# EAGLE design powersupplyboard (EAGLE 9.6.2)
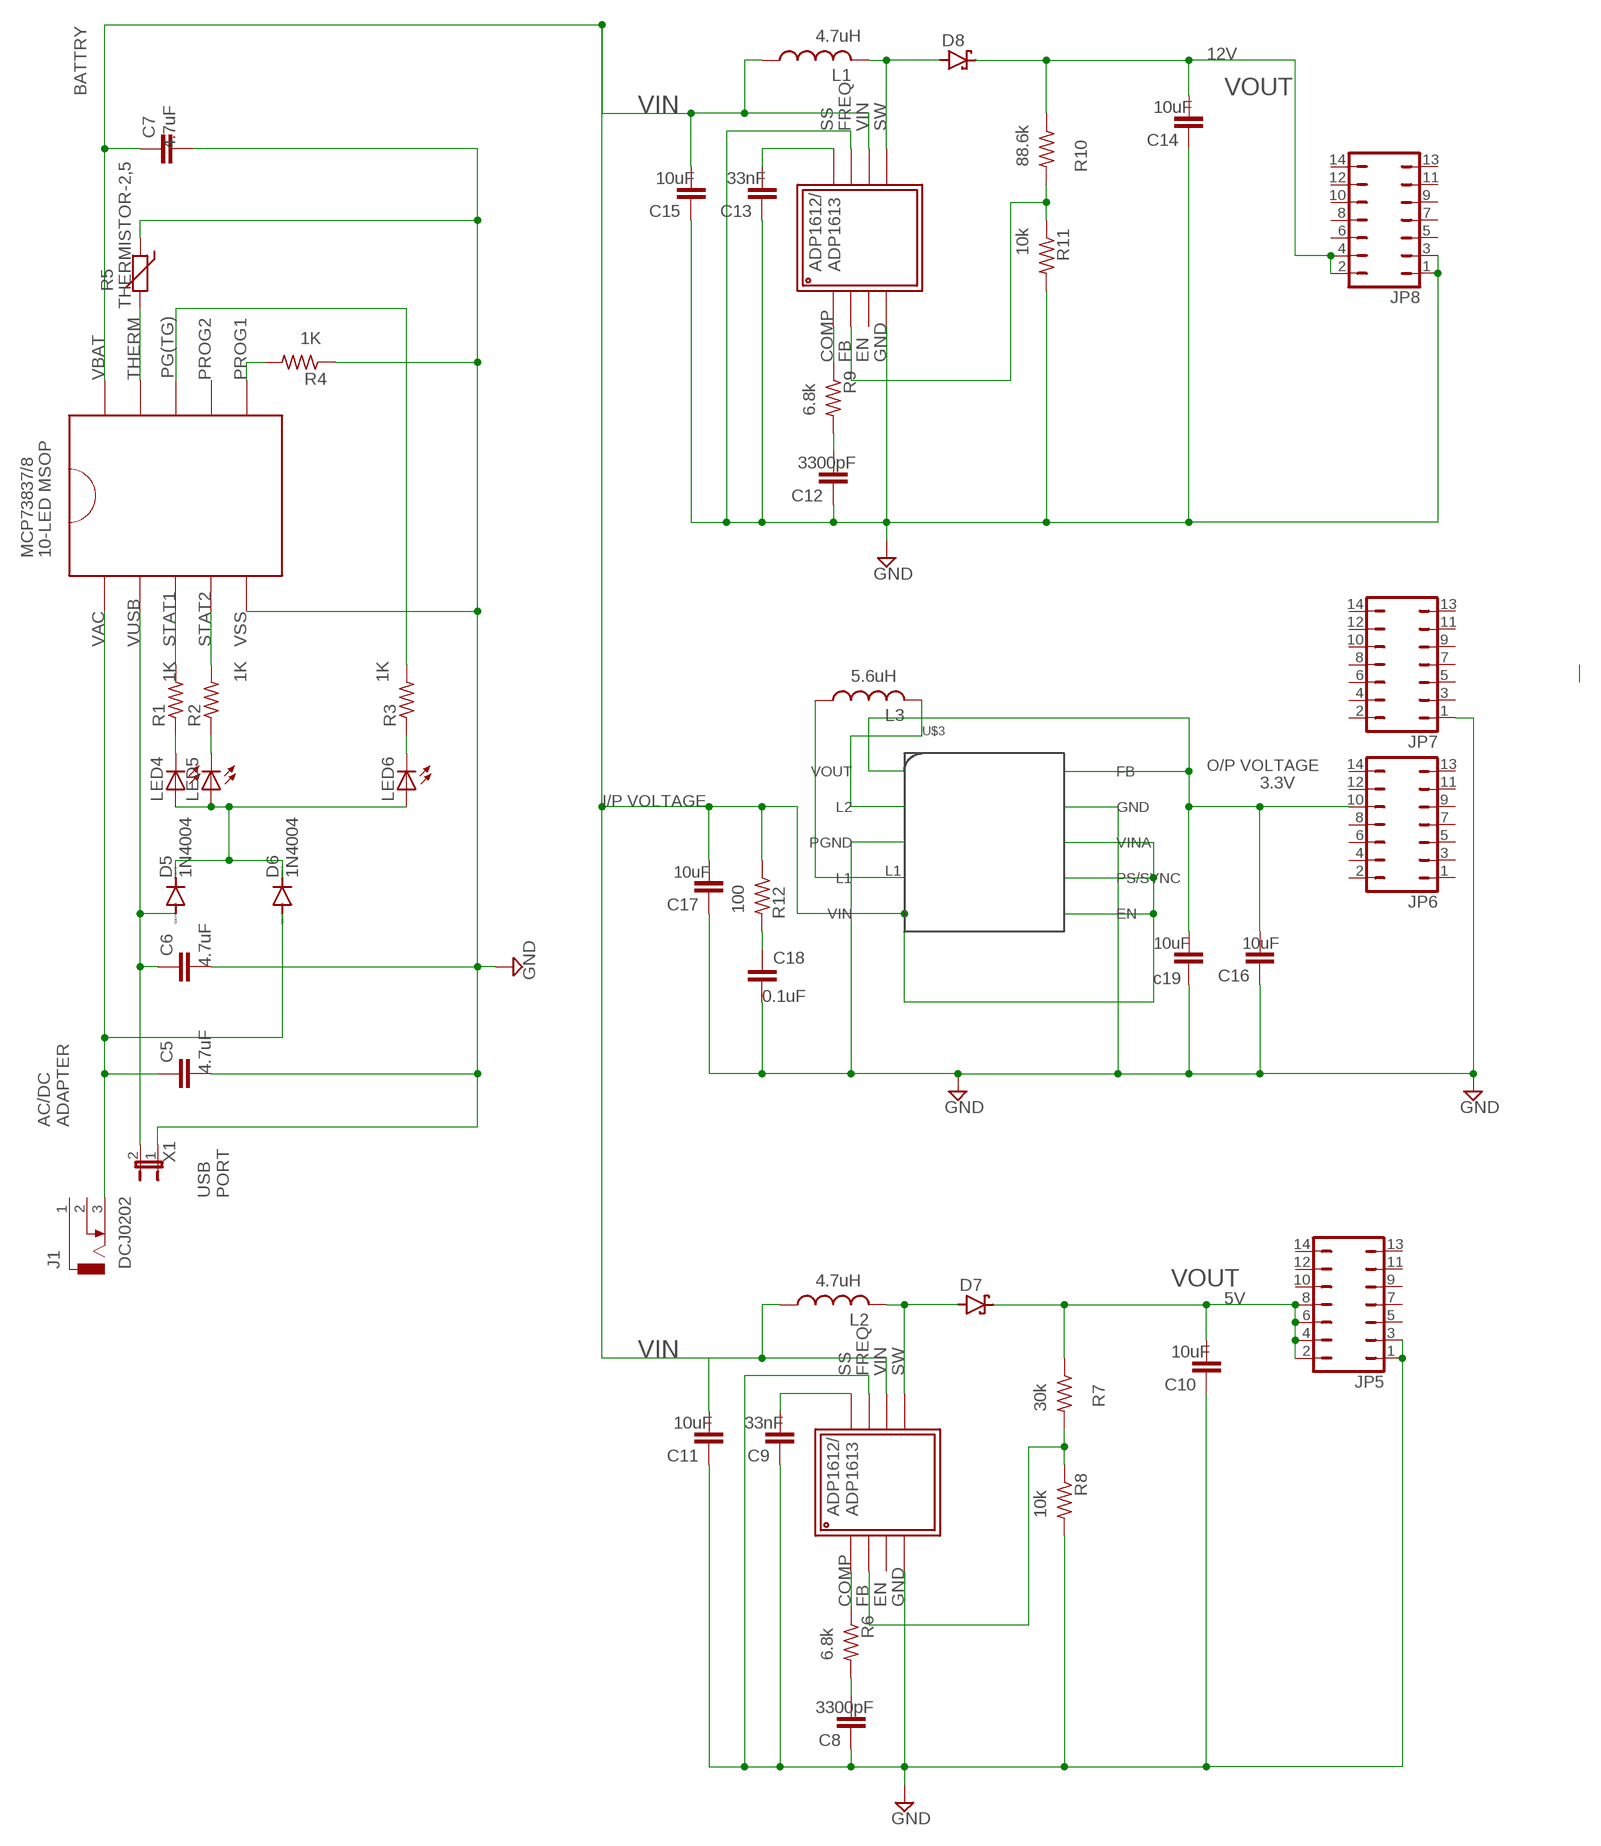
[diagram p0: schematic, sheet 1]

## Parts
C1  C2,5-3  [C2.5-3]
C5  C2.5/5  [C2.5-5]
C6  C2.5/5  [C2.5-5]
C7  C2.5/5  [C2.5-5]
C8  C2,5-3  [C2.5-3]
C9  C2,5-3  [C2.5-3]
C10  C2,5-3  [C2.5-3]
C11  C2,5-3  [C2.5-3]
C12  C2,5-3  [C2.5-3]
C13  C2,5-3  [C2.5-3]
C14  C2,5-3  [C2.5-3]
C15  C2,5-3  [C2.5-3]
C16  C2,5-3  [C2.5-3]
C17  C2,5-3  [C2.5-3]
C18  C2,5-3  [C2.5-3]
D5  1N4004  [DO41-10]
D6  1N4004  [DO41-10]
D7  SCHOTTKY-DIODEC4111-15  [C4111-15]
D8  SCHOTTKY-DIODEC4111-15  [C4111-15]
J1  DCJ0202  [DCJ0202]
JP1  JP1E  [JP1]
JP5  JP7Q  [JP7Q]
JP6  JP7Q  [JP7Q]
JP7  JP7Q  [JP7Q]
JP8  JP7Q  [JP7Q]
L1  L-US0204/5  [0204/5]
L2  L-US0204/5  [0204/5]
L3  L-US0204/5  [0204/5]
LED4  LED3MM  [LED3MM]
LED5  LED3MM  [LED3MM]
LED6  LED3MM  [LED3MM]
R1  R-US_0204/2V  [0204V]
R2  R-US_0204/2V  [0204V]
R3  R-US_0204/2V  [0204V]
R4  R-US_0204/2V  [0204V]
R5  THERMISTOR-2,5  [RS-2,5]
R6  R-US_0204/2V  [0204V]
R7  R-US_0204/2V  [0204V]
R8  R-US_0204/2V  [0204V]
R9  R-US_0204/2V  [0204V]
R10  R-US_0204/2V  [0204V]
R11  R-US_0204/2V  [0204V]
R12  R-US_0204/2V  [0204V]
U$1  ADP1612  [ADP1612]
U$2  ADP1612  [ADP1612]
U$3  TPS63002  [TPS63002]
U$4  MCP73837/8  [MCP73837/8]

## Nets
GND: C1.1 C5.2 C6.2 C7.2 C8.1 C9.1 C10.1 C11.1 C12.1 C13.1 C14.1 C15.1 C16.1 C17.1 C18.2 JP1.1 JP5.1 JP5.3 JP7.1 JP8.1 JP8.3 R4.1 R5.1 R8.2 R11.2 U$1.P$4 U$1.P$6 U$2.P$4 U$2.P$6 U$3.GND U$3.PGND U$4.P$5
N$1: C7.1 C11.2 C15.2 C17.2 L1.1 L2.1 R12.1 U$1.P$7 U$2.P$7 U$3.EN U$3.PS/SYNC U$3.VIN U$3.VINA U$4.P$10
N$2: L3.1 U$3.L1
N$4: C1.2 C16.2 JP6.10 U$3.FB U$3.VOUT
N$5: L3.2 U$3.L2
N$6: C18.1 R12.2
N$7: C5.1 D6.A J1.3 U$4.P$1
N$8: C10.2 D7.C JP5.2 JP5.4 JP5.6 JP5.8 R7.1
N$9: C14.2 D8.C JP8.2 JP8.4 R10.1
N$11: C6.1 D5.A JP1.2 U$4.P$2
N$12: D5.C D6.C LED4.A LED5.A LED6.A
N$13: R4.2 U$4.P$6
N$14: R5.2 U$4.P$9
N$15: LED4.K(C) R1.1
N$16: R1.2 U$4.P$3
N$17: R2.2 U$4.P$4
N$18: LED5.K(C) R2.1
N$19: LED6.K(C) R3.1
N$20: R3.2 U$4.P$8
N$24: D7.A L2.2 U$1.P$8
N$25: R6.1 U$1.P$1
N$26: C8.2 R6.2
N$27: R7.2 R8.1 U$1.P$2
N$28: C9.2 U$1.P$5
N$30: D8.A L1.2 U$2.P$8
N$32: R9.1 U$2.P$1
N$33: C12.2 R9.2
N$34: R10.2 R11.1 U$2.P$2
N$35: C13.2 U$2.P$5
Unconnected: J1.1 J1.2 JP5.5 JP5.7 JP5.9 JP5.10 JP5.11 JP5.12 JP5.13 JP5.14 JP6.1 JP6.2 JP6.3 JP6.4 JP6.5 JP6.6 JP6.7 JP6.8 JP6.9 JP6.11 JP6.12 JP6.13 JP6.14 JP7.2 JP7.3 JP7.4 JP7.5 JP7.6 JP7.7 JP7.8 JP7.9 JP7.10 JP7.11 JP7.12 JP7.13 JP7.14 JP8.5 JP8.6 JP8.7 JP8.8 JP8.9 JP8.10 JP8.11 JP8.12 JP8.13 JP8.14 U$1.P$3 U$2.P$3 U$4.P$7

## Notes on the sheet
- 4.7uH
- 12V
- BATTRY | VOUT
- VIN | 10uF
- 4.7uF
- 88.6k
- 10uF | 33nF
- 10k
- 1K
- 6.8k
- 3300pF
- 1K | 1K | 1K | 5.6uH
- O/P VOLTAGE
- 3.3V
- I/P VOLTAGE
- 10uF
- 100
- 10uF | 10uF
- 4.7uF
- c19
- 0.1uF
- 4.7uF
- AC/DC
  ADAPTER
- X1
- USB
  PORT
- 4.7uH | VOUT
- 5V
- VIN | 10uF
- 30k
- 10uF | 33nF
- 10k
- 6.8k
- 3300pF

## Library data of the parts
C1 C5-C18 = capacitor-wima:C: CAPACITOR naming: grid - package width
D5 D6 = diode:1N4004: DIODE general purpose rectifier, 1 A
D7 D8 = diode:SCHOTTKY-DIODE: Schottky Diode
J1 = con-jack:DCJ0202: DC POWER JACK Source: DCJ0202.pdf; OC_FARNELL: unknown; OC_NEWARK: unknown
JP1 = jumper:JP1E: JUMPER
JP5-JP8 = jumper:JP7Q: JUMPER
L1-L3 = rcl:L-US: INDUCTOR, American symbol; SPICEPREFIX: L
LED4-LED6 = adafruit:LED: LED OSRAM: - CHIPLED LG R971, LG N971, LY N971, LG Q971, LY Q971, LO R971, LY R971 LH N974, LH R974 LS Q976, LO Q976, LY Q976 LO Q996 - Hyper CHIPLED LW Q18S LB Q993, LB Q99A, LB R99A - SideLED LS A670, LO A670, LY A670, LG A670, LP A670 LB A673, LV A673, LT A673, LW A673 LH A674 LY A675 LS A676, LA A676, LO A676, LY A676, LW A676 LS A679, LY A679, LG A679 - Hyper Micro SIDELED® LS Y876, LA Y876, LO Y876, LY Y876 LT Y87S - SmartLED LW L88C, LW L88S LB L89C, LB L89S, LG L890 LS L89K, LO L89K, LY L89K LS L896, LA L896, LO L896, LY L896 - TOPLED LS T670, LO T670, LY T670, LG T670, LP T670 LSG T670, LSP T670, LSY T670, LOP T670, LYG T670 LG T671, LOG T671, LSG T671 LB T673, LV T673, LT T673, LW T673 LH T674 LS T676, LA T676, LO T676, LY T676, LB T676, LH T676, LSB T676, LW T676 LB T67C, LV T67C, LT T67C, LS T67K, LO T67K, LY T67K, LW E67C LS E67B, LA E67B, LO E67B, LY E67B, LB E67C, LV E67C, LT E67C LW T67C LS T679, LY T679, LG T679 LS T770, LO T770, LY T770, LG T770, LP T770 LB T773, LV T773, LT T773, LW T773 LH T774 LS E675, LA E675, LY E675, LS T675 LS T776, LA T776, LO T776, LY T776, LB T776 LHGB T686 LT T68C, LB T68C - Hyper Mini TOPLED® LB M676 - Mini TOPLED Santana® LG M470 LS M47K, LO M47K, LY M47K Source: http://www.osram.convergy.de/
R1-R4 R6-R12 = rcl:R-US_: RESISTOR, American symbol; SPICEPREFIX: R
R5 = varistor:THERMISTOR: THERMISTOR
U$1 U$2 = ADP1612:ADP1612
U$3 = TPS63002:TPS63002
U$4 = MCP73837:MCP73837/8

## Board
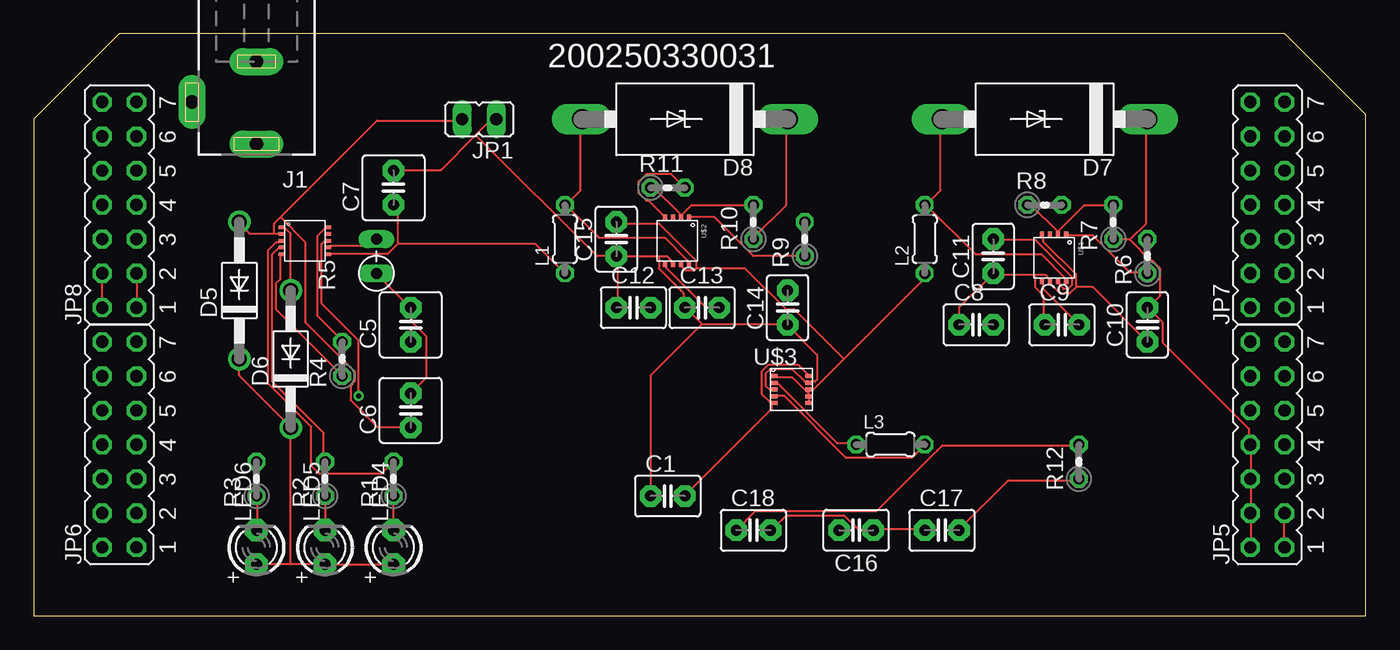
[diagram p1: board, top side]
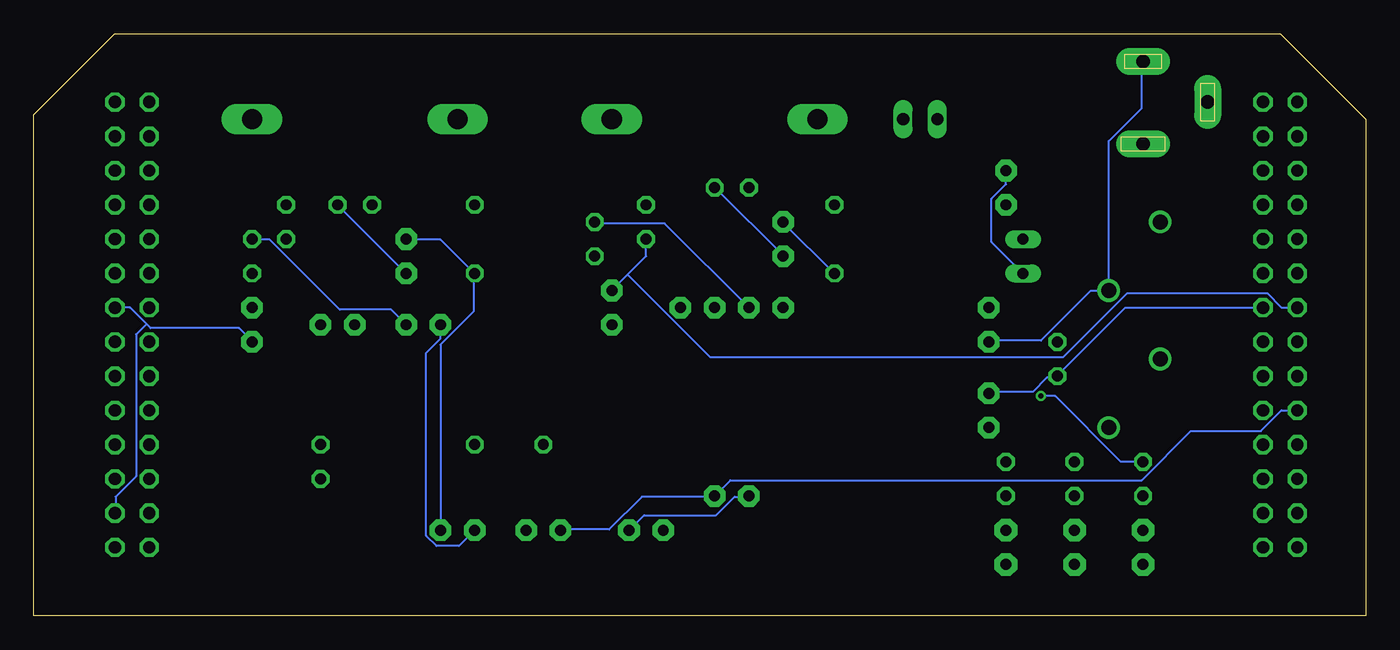
[diagram p2: board, bottom side, seen from below]

Size 98.73 x 43.17 mm. Coordinates in mm from the lower left corner, seen from the top.
Outline: 0,0 98.73,0 98.73,37.16 92.72,43.17 6.34,43.17 0,36.83 0,0
Copper layers (1*16): Top 0.035mm / dielectric 1.5mm / Bottom 0.035mm
Design rules "default": minimum track width 6mil, minimum drill 0.35mm, track to track 6mil, track to pad 6mil, pad to pad 6mil, via to via 6mil, smd to smd 6mil, copper to edge 40mil, drill to drill 6mil, minimum pad ring 10mil, minimum via ring 8mil, stop-mask expansion 4mil, vias tented up to drill 0mil, thermal gap 10mil

### Footprints (pad centres in the part's own frame; a part is rotated, then mirrored left to right if it is on the bottom)
C2.5-3 = drill 0.813 pad 1.6 octagon: 1 -1.27,0; 2 1.27,0
C2.5-5 = drill 0.813 pad 1.6 octagon: 1 -1.27,0; 2 1.27,0
DO41-10 = drill 1.118: A 5.08,0; C -5.08,0
C4111-15 = drill 1.499 long: A 7.62,0; C -7.62,0
DCJ0202 = drill 1 pad 2 long: 1 0,3.1; 2 4.8,0; 3 0,-3
JP1 = drill 0.914 long: 1 0,-1.27; 2 0,1.27
JP7Q = drill 0.914 octagon: 1 -7.62,-1.27; 2 -7.62,1.27; 3 -5.08,-1.27; 4 -5.08,1.27; 5 -2.54,-1.27; 6 -2.54,1.27; 7 0,-1.27; 8 0,1.27; 9 2.54,-1.27; 10 2.54,1.27; 11 5.08,-1.27; 12 5.08,1.27; 13 7.62,-1.27; 14 7.62,1.27
0204/5 = drill 0.813 octagon: 1 -2.54,0; 2 2.54,0
LED3MM = drill 0.813 pad 1.676 octagon: A -1.27,0; K 1.27,0
0204V = drill 0.813 octagon: 1 -1.27,0; 2 1.27,0
RS-2,5 = drill 0.813 long: 1 -1.27,0; 2 1.27,0
ADP1612 = smd 0.4 x 0.3: P$1 -9.25,5.4; P$2 -9.25,4.8; P$3 -9.25,4.2; P$4 -9.25,3.6; P$5 -5.75,3.6; P$6 -5.75,4.2; P$7 -5.75,4.8; P$8 -5.75,5.4
TPS63002 = smd 0.5 x 0.3: EN 2.85,0.55; FB 2.85,2.55; GND 2.85,2.05; L1 0.25,2.05; L2 0.25,1.05; PGND 0.25,1.55; PS/SYNC 2.85,1.05; VIN 0.25,2.55; VINA 2.85,1.55; VOUT 0.25,0.55
MCP73837/8 = smd 0.4 x 0.25: P$1 -3.25,8.5; P$2 -3.25,8; P$3 -3.25,7.5; P$4 -3.25,7; P$5 -3.25,6.5; P$6 0.25,8.5; P$7 0.25,8; P$8 0.25,7.5; P$9 0.25,7; P$10 0.25,6.5

### Placement (x,y rotation side)
C1  46.99,8.89 0 top
C5  27.94,21.59 90 top
C6  27.94,15.24 90 top
C7  26.67,31.75 90 top
C8  69.85,21.59 0 top
C9  76.2,21.59 0 top
C10  82.55,21.59 90 top
C11  71.12,26.67 90 top
C12  44.45,22.86 0 top
C13  49.53,22.86 0 top
C14  55.88,22.86 90 top
C15  43.18,27.94 90 top
C16  60.96,6.35 180 top
C17  67.31,6.35 0 top
C18  53.34,6.35 0 top
D5  15.24,24.13 90 top
D6  19.05,19.05 90 top
D7  74.93,36.83 180 top
D8  48.26,36.83 180 top
J1  16.51,38.1 180 top
JP1  33.02,36.83 90 top
JP5  91.44,12.7 90 top
JP6  6.35,12.7 90 top
JP7  91.44,30.48 90 top
JP8  6.35,30.48 90 top
L1  39.37,27.94 90 top
L2  66.04,27.94 90 top
L3  63.5,12.7 0 top
LED4  26.67,5.08 90 top
LED5  21.59,5.08 90 top
LED6  16.51,5.08 90 top
R1  26.67,10.16 90 top
R2  21.59,10.16 90 top
R3  16.51,10.16 90 top
R4  22.86,19.05 90 top
R5  25.4,26.67 90 top
R6  82.55,26.67 90 top
R7  80.01,29.21 90 top
R8  74.93,30.48 0 top
R9  57.15,27.94 90 top
R10  53.34,29.21 90 top
R11  46.99,31.75 0 top
R12  77.47,11.43 90 top
U$1  71.12,19.05 270 top
U$2  43.18,20.32 270 top
U$3  54.61,15.24 0 top
U$4  21.59,20.32 0 top

### Tracks (layer width: path | path; a pad name or v marks a point on that pad's centre or on a via)
GND
  Top 0.152: 74.22,25.3 71.17,25.3 C11.1 68.58,22.86 C8.1 | 74.22,25.3 74.98,25.3 75.29,24.99 75.29,24.84 U$1.P$6 75.29,24.69 76.05,23.93 76.81,23.93 77.27,24.38 | 77.27,24.38 77.27,25.3 74.83,27.74 74.83,28.19 U$1.P$4 | 74.22,25.3 74.22,24.38 74.83,23.77 74.83,21.64 C9.1 | JP5.1 92.66,5.18 92.66,7.62 JP5.3 | 77.27,24.38 78.49,24.38 C10.1 | 32.77,35.66 30.18,33.07 26.67,33.07 C7.2 | 32.77,35.66 33.83,36.73 34.29,36.73 JP1.1 | R5.1 25.45,25.3 27.89,22.86 C5.2 28.04,22.86 28.04,21.79 29.11,20.73 29.11,17.68 C6.2 | JP8.3 JP8.1 | U$4.P$5 18.29,26.82 18.29,24.99 17.98,24.69 17.98,22.71 22.86,17.83 R4.1 | C17.1 65.99,6.4 62.33,6.4 C16.1 62.18,6.4 61.11,6.4 60.05,7.47 55.78,7.47 54.71,6.4 C18.2 | U$3.PGND 54.71,16.76 54.56,16.76 54.25,17.07 54.25,17.98 54.56,18.29 56.24,18.29 57.15,17.37 57.45,17.37 U$3.GND 57.61,17.37 57.91,17.37 58.06,17.53 58.06,19.35 55.93,21.49 C14.1 55.78,21.64 49.53,21.64 | R11.2 47.24,32.77 45.41,32.77 44.81,32.16 44.81,31.39 45.41,30.78 45.57,30.78 46.63,29.72 U$2.P$4 | 43.28,26.67 46.33,26.67 | 46.33,26.67 46.94,26.67 47.24,26.36 47.24,26.21 U$2.P$6 | 43.28,26.67 43.28,22.86 C12.1 | 43.28,26.67 C15.1 41.76,26.67 32.77,35.66 | 46.33,26.67 46.33,25.76 48.16,23.93 48.16,22.86 C13.1 48.31,22.86 49.53,21.64 | C1.1 45.72,17.83 49.53,21.64
  Bottom 0.152: C11.1 R8.2 | JP7.1 91.59,22.86 90.37,21.64 | 90.37,21.64 90.07,21.34 83.52,21.34 82.6,20.42 C10.1 | 90.37,21.64 91.13,20.88 91.13,10.36 92.66,8.84 92.66,7.62 JP5.3 | C6.2 27.89,16.61 24.69,16.61 23.62,17.68 22.86,17.68 R4.1 22.86,17.83 17.83,22.86 JP8.1 | C7.2 26.67,32 27.74,30.94 27.74,27.74 R5.1 | C18.2 53.49,7.47 48.16,7.47 46.79,8.84 45.72,8.84 C1.1 | R11.2 48.16,31.7 43.13,26.67 C15.1 | C8.1 68.58,20.57 69.65,19.51 69.65,5.94 68.88,5.18 67.21,5.18 C17.1
N$1
  Top 0.152: 26.98,27.58 26.21,26.82 21.95,26.82 U$4.P$10 | 26.98,27.58 26.98,30.17 C7.1 | 49.07,25.76 48.92,25.6 48.31,25.6 48.01,25.91 48.01,26.06 U$2.P$7 | 49.07,25.76 49.07,26.36 46.33,29.11 43.28,29.11 C15.2 | 26.98,27.58 37.19,27.58 L1.1 | R12.1 77.42,10.06 72.24,10.06 68.58,6.4 C17.2 | U$1.P$7 76.05,24.69 76.05,24.54 76.35,24.23 76.66,24.23 76.96,24.54 76.96,25.15 74.22,27.89 71.17,27.89 C11.2 | U$3.EN 57.45,15.85 57.45,16.15 U$3.PS/SYNC 57.45,16.31 57.45,16.46 | 57.45,16.46 57.45,16.76 U$3.VINA 57.61,16.76 57.76,16.76 60.05,19.05 | 57.45,16.46 56.24,17.68 54.86,17.68 U$3.VIN | 60.05,19.05 65.99,24.99 65.99,25.3 L2.1 | 49.07,25.76 52.73,25.76 55.78,22.71 56.39,22.71 60.05,19.05
  Bottom 0.152: L1.1 39.47,25.45 43.13,29.11 C15.2 | C11.2 71.02,27.89 68.58,27.89 66.14,25.45 L2.1 66.14,25.3 66.14,22.55 68.58,20.12 C17.2
N$2
  Top 0.152: U$3.L1 54.86,17.22 55.17,17.22 59.59,12.8 60.96,12.8 L3.1
N$4
  Top 0.152: U$3.FB 57.45,17.83 56.69,18.59 54.41,18.59 53.95,18.14 53.95,16.46 54.56,15.85 54.71,15.85 U$3.VOUT 54.71,15.7 54.71,15.39 48.31,8.99 C1.2
  Bottom 0.152: JP6.10 6.25,15.24 7.77,13.72 12.95,13.72 16.61,10.06 47.09,10.06 C1.2 48.31,8.84 53.64,8.84 56.08,6.4 59.59,6.4 C16.2
N$5
  Top 0.152: L3.2 65.08,11.74 60.2,11.74 55.63,16.31 54.86,16.31 U$3.L2
N$6
  Top 0.152: C18.1 53.49,7.77 62.48,7.77 67.36,12.65 77.42,12.65 R12.2
N$7
  Top 0.152: D6.A 19.05,28.35 18.59,28.8 18.44,28.8 U$4.P$1
  Bottom 0.152: C5.1 27.89,20.42 24.08,20.42 20.42,24.08 19.05,24.08 D6.A 19.05,35.2 16.61,37.64 16.61,41 J1.3
N$8
  Top 0.152: 90.22,7.62 90.22,5.18 JP5.2 | 90.22,7.62 90.22,10.06 JP5.6 90.22,10.21 90.22,12.65 JP5.8 90.07,12.8 90.07,13.87 83.67,20.27 83.67,21.79 82.6,22.86 | 90.22,7.62 JP5.4 | 81.23,27.89 80.01,27.89 R7.1 | 81.23,27.89 82.75,26.36 82.91,26.36 83.52,25.76 83.52,23.77 82.6,22.86 | 81.23,27.89 82.45,29.11 82.45,36.73 D7.C | 82.6,22.86 C10.2
N$9
  Top 0.152: JP8.2 5.03,22.86 5.03,25.3 JP8.4 | D8.C 55.78,36.73 55.78,30.48 53.34,28.04 R10.1
  Bottom 0.152: R10.1 53.34,26.67 54.71,25.3 | C14.2 54.71,25.3 | JP8.2 6.25,22.86 7.31,23.93 17.68,23.93 22.4,19.2 48.62,19.2 54.71,25.3
N$11
  Top 0.152: 17.83,28.35 16,28.35 15.24,29.11 D5.A | 17.83,28.35 18.29,28.35 U$4.P$2 | 18.29,29.57 17.83,29.11 17.83,28.35 | 18.29,29.57 25.45,36.73 31.7,36.73 JP1.2 | 18.29,29.57 20.12,27.74 20.12,21.79 23.77,18.14 23.77,17.37 23.47,17.07 23.47,16 25.45,14.02 27.89,14.02 C6.1
N$12
  Top 0.152: D5.C 15.24,17.83 19.05,14.02 D6.C 19.05,3.81 | 19.05,3.81 LED5.A LED4.A | 19.05,3.81 LED6.A
N$13
  Top 0.152: U$4.P$6 21.79,28.8 21.64,28.8 21.03,28.19 21.03,22.25 22.86,20.42 R4.2
N$14
  Top 0.152: U$4.P$9 21.95,27.43 24.84,27.43 25.3,27.89 R5.2
N$15
  Top 0.152: LED4.K R1.1
N$16
  Top 0.152: R1.2 25.76,10.52 21.18,10.52 20.57,11.12 20.57,14.02 17.37,17.22 17.37,27.13 17.98,27.74 18.29,27.74 U$4.P$3
N$17
  Top 0.152: U$4.P$4 18.29,27.28 18.14,27.28 17.68,26.82 17.68,17.37 21.49,13.56 21.49,11.43 R2.2
N$18
  Top 0.152: R2.1 21.64,8.84 21.64,6.4 LED5.K
N$19
  Top 0.152: R3.1 16.61,8.84 16.61,6.4 LED6.K
N$20  (via drill 0.35)
  Top 0.152: v24.08,16.31 24.08,20.42 21.34,23.16 21.34,27.58 21.49,27.74 21.79,27.74 U$4.P$8
  Bottom 0.152: v24.08,16.31 23.01,16.31 18.14,11.43 R3.2
N$24
  Top 0.152: 66.14,30.48 69.8,26.82 74.68,26.82 76.5,24.99 76.5,24.84 U$1.P$8 | 66.14,30.48 67.21,31.55 67.21,36.73 D7.A | 66.14,30.48 L2.2
N$25
  Top 0.152: U$1.P$1 76.66,28.19 78.49,28.19 81.23,25.45 82.45,25.45 R6.1
N$26
  Bottom 0.152: C8.2 72.24,22.71 76.05,22.71 81.23,27.89 82.45,27.89 R6.2
N$27
  Top 0.152: 75.89,28.5 75.89,28.35 U$1.P$2 75.89,28.5 | 75.89,28.5 73.91,30.48 R8.1 | R7.2 77.88,30.48 75.89,28.5
N$28
  Top 0.152: C9.2 74.83,24.23 74.83,24.69 U$1.P$5
N$30
  Top 0.152: 39.47,30.48 41.91,28.04 46.79,28.04 48.46,26.36 48.46,26.21 U$2.P$8 | 39.47,30.48 40.54,31.55 40.54,36.73 D8.A | 39.47,30.48 L1.2
N$32
  Top 0.152: R9.1 53.34,26.67 50.44,29.57 48.62,29.57 U$2.P$1
N$33
  Bottom 0.152: C12.2 51.97,29.11 57.15,29.11 R9.2
N$34
  Top 0.152: R11.1 45.72,31.7 46.02,31.7 47.85,29.87 47.85,29.72 U$2.P$2 48.01,29.72 48.77,30.48 R10.2
N$35
  Top 0.152: C13.2 49.84,22.86 46.79,25.91 U$2.P$5

### Text on the board
tNames: 200250330031